# Altium schematic sheet sigma-delta-adc-uart.SchDoc
size A4; SheetNumber: 1; SheetTotal: 1
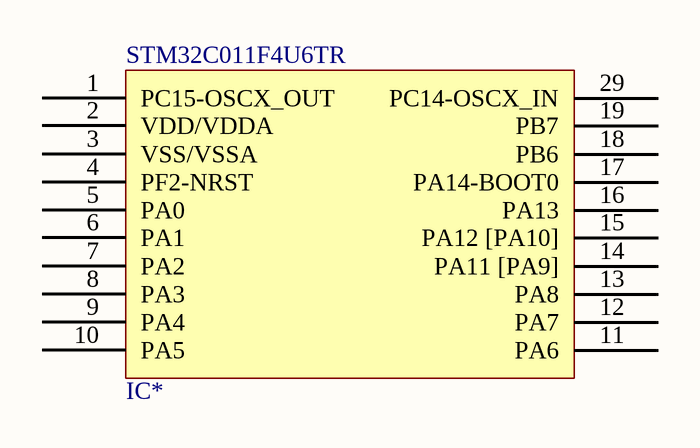
[diagram p0: sigma-delta-adc-uart.SchDoc]

## Parts
IC*  STM32C011F4U6TR  (value not drawn)

## Nets

Not connected (* = marked no-connect by the designer): IC* 1(PC15-OSCX_OUT) 2(VDD/VDDA) 3(VSS/VSSA) 4(PF2-NRST) 5(PA0) 6(PA1) 7(PA2) 8(PA3) 9(PA4) 10(PA5) 11(PA6) 12(PA7) 13(PA8) 14(PA11_[PA9]) 15(PA12_[PA10]) 16(PA13) 17(PA14-BOOT0) 18(PB6) 19(PB7) 29(PC14-OSCX_IN)

## Library data of the parts
IC* = STM32C011F4U6TR: ComponentLink1Description: Datasheet; ComponentLink1URL: https://www.alldatasheet.com/datasheet-pdf/download/1583958/STMICROELECTRONICS/STM32C011F4U6TR.html